# EAGLE design icemaker (EAGLE 9.2.2)
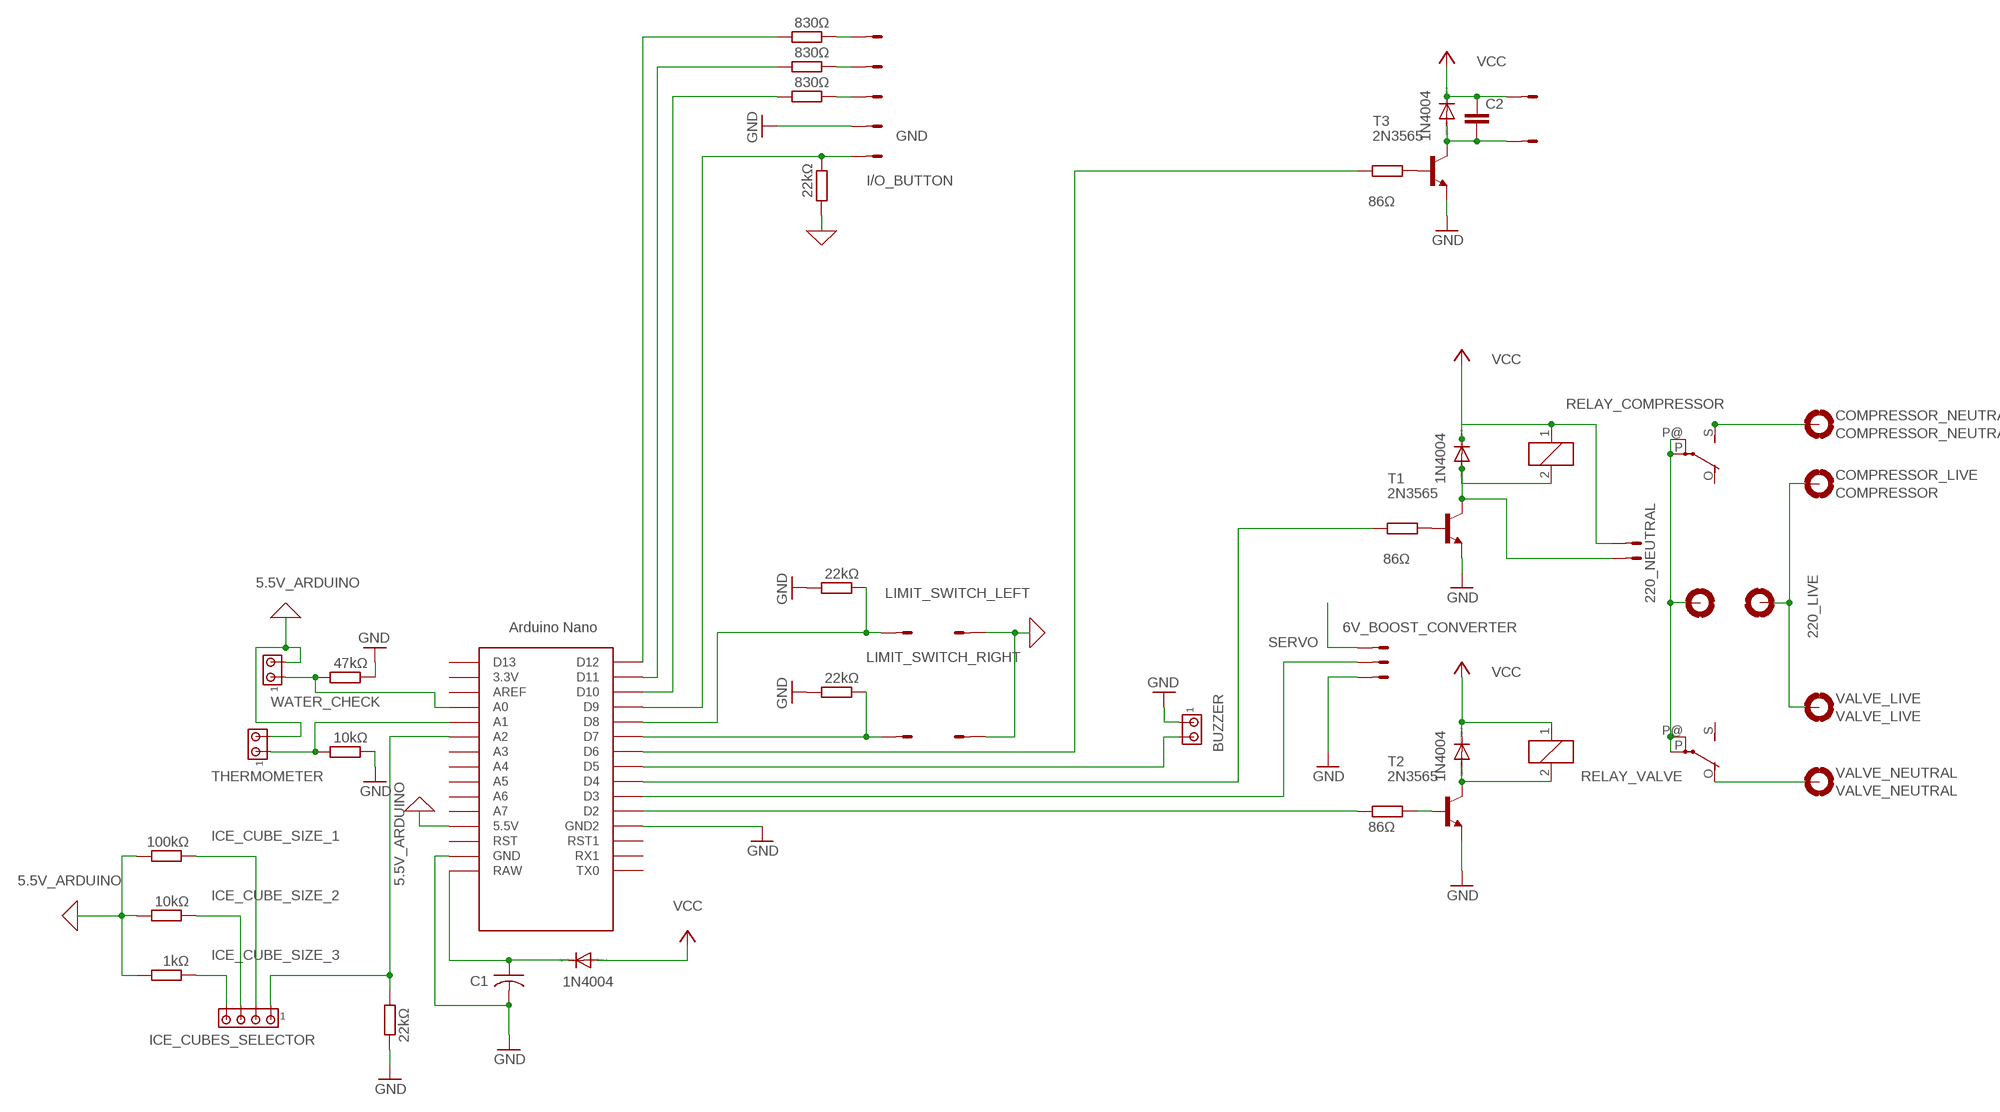
[diagram p0: schematic, sheet 1]

## Parts
220_LIVE  220_LIVE  MOUNT-PAD-ROUND2.8  [2,8-PAD]
220_NEUTRLA  220_NEUTRAL  MOUNT-PAD-ROUND2.8  [2,8-PAD]
BUZZER  MTA02-156  [1X2MTA]
C1  C-US050-025X075  [C050-025X075]
C2  C2,5-3  [C2.5-3]
COMPRESSOR_LIVE  COMPRESSOR  MOUNT-PAD-ROUND2.8  [2,8-PAD]
COMPRESSOR_NEUTRAL  COMPRESSOR_NEUTRAL  MOUNT-PAD-ROUND2.8  [2,8-PAD]
D1  1N4004  [DO41-10]
D2  1N4004  [DO41-10]
D3  1N4004  [DO41-10]
D4  1N4004  [DO41-10]
FAN  L02P  [L02P]
ICE_CUBES_SELECTOR  MTA04-156  [1X4MTA]
LED_WORK  I/O_BUTTON  L05P  [L05P]
PUMP  L02P  [L02P]
R1  86Ω  R-EU_0204/5  [0204/5]
R2  86Ω  R-EU_0204/5  [0204/5]
R3  86Ω  R-EU_0204/5  [0204/5]
R4  1kΩ  R-EU_0204/5  [0204/5]
R5  47kΩ  R-EU_0204/5  [0204/5]
R6  10kΩ  R-EU_0204/5  [0204/5]
R7  830Ω  R-EU_0204/5  [0204/5]
R8  830Ω  R-EU_0204/5  [0204/5]
R9  830Ω  R-EU_0204/5  [0204/5]
R10  22kΩ  R-EU_0204/5  [0204/5]
R11  22kΩ  R-EU_0204/5  [0204/5]
R12  22kΩ  R-EU_0204/5  [0204/5]
R13  10kΩ  R-EU_0204/5  [0204/5]
R14  100kΩ  R-EU_0204/5  [0204/5]
R16  22kΩ  R-EU_0204/5  [0204/5]
RELAY_COMPRESSOR  M3XXH  [M3XXH]
RELAY_VALVE  M3XXH  [M3XXH]
SERVO  S03P  [S03P]
SV1  L04P  [L04P]
T1  2N3565  [TO92]
T2  2N3565  [TO92]
T3  2N3565  [TO92]
THERMOMETER  MTA02-156  [1X2MTA]
U$1  NANO  [NANO]
VALVE_LIVE  VALVE_LIVE  MOUNT-PAD-ROUND2.8  [2,8-PAD]
VALVE_NEUTRAL  VALVE_NEUTRAL  MOUNT-PAD-ROUND2.8  [2,8-PAD]
WATER_CHECK  MTA02-156  [1X2MTA]

## Nets
5.5V_ARDUINO: R4.2 R10.2 R13.2 R14.2 SV1.2 SV1.3 THERMOMETER.2 U$1.5V(5.5V) WATER_CHECK.2
6V_BOOST_CONVERTER: SERVO.3
220_NEUTRAL: 220_NEUTRLA.B2,8(MOUNT) RELAY_COMPRESSOR.P(2:P) RELAY_COMPRESSOR.P@(2:P) RELAY_VALVE.P(2:P) RELAY_VALVE.P@(2:P)
220V: 220_LIVE.B2,8(MOUNT) COMPRESSOR_LIVE.B2,8(MOUNT) VALVE_LIVE.B2,8(MOUNT)
BUZZER: BUZZER.2 U$1.D5
GND: BUZZER.1 C1.2 LED_WORK.2 R5.1 R6.1 R11.2 R12.2 R16.1 SERVO.1 T1.3(E) T2.3(E) T3.3(E) U$1.GND U$1.GND1(GND2)
I/O_BUTTON: LED_WORK.1 R10.1 U$1.D9
ICE_CUBE_SIZE_1: ICE_CUBES_SELECTOR.2 R14.1
ICE_CUBE_SIZE_2: ICE_CUBES_SELECTOR.3 R13.1
ICE_CUBE_SIZE_3: ICE_CUBES_SELECTOR.4 R4.1
LIMIT_SWITCH_LEFT: R11.1 SV1.4 U$1.D8
LIMIT_SWITCH_RIGHT: R12.1 SV1.1 U$1.D7
N$1: D1.A RELAY_VALVE.2 T2.1(C)
N$2: R3.2 U$1.D2
N$3: R2.2 U$1.D6
N$4: R2.1 T3.2(B)
N$5: R3.1 T2.2(B)
N$6: R1.2 U$1.D4
N$7: LED_WORK.5 R7.1
N$8: LED_WORK.4 R8.1
N$9: R7.2 U$1.D12
N$10: R8.2 U$1.D11
N$11: R9.2 U$1.D10
N$12: LED_WORK.3 R9.1
N$13: R1.1 T1.2(B)
N$14: D2.A FAN.1 RELAY_COMPRESSOR.2 T1.1(C)
N$15: C1.1 D3.C U$1.RAW
N$16: RELAY_VALVE.O(2:O) VALVE_NEUTRAL.B2,8(MOUNT)
N$17: COMPRESSOR_NEUTRAL.B2,8(MOUNT) RELAY_COMPRESSOR.S(2:S)
N$19: ICE_CUBES_SELECTOR.1 R16.2 U$1.A2
N$20: C2.2 D4.A PUMP.1 T3.1(C)
SERVO: SERVO.2 U$1.D3
THERMOMETER: R6.2 THERMOMETER.1 U$1.A1
VCC: C2.1 D1.C D2.C D3.A D4.C FAN.2 PUMP.2 RELAY_COMPRESSOR.1 RELAY_VALVE.1
WATER_CHECK: R5.2 U$1.A0 WATER_CHECK.1
Unconnected: RELAY_COMPRESSOR.O(2:O) RELAY_VALVE.S(2:S) U$1.3.3V U$1.A3 U$1.A4 U$1.A5 U$1.A6 U$1.A7 U$1.AREF U$1.D13 U$1.ICSP1 U$1.ICSP2 U$1.ICSP3 U$1.ICSP4 U$1.ICSP5 U$1.ICSP6 U$1.RST U$1.RST1 U$1.RX1 U$1.TX0

## Library data of the parts
220_LIVE 220_NEUTRLA COMPRESSOR_LIVE COMPRESSOR_NEUTRAL VALVE_LIVE VALVE_NEUTRAL = holes:MOUNT-PAD-ROUND: MOUNTING PAD, round
BUZZER THERMOMETER WATER_CHECK = con-amp:MTA02-156: AMP connector
C1 = rcl:C-US: CAPACITOR, American symbol; SPICEPREFIX: C
C2 = capacitor-wima:C: CAPACITOR naming: grid - package width
D1-D4 = diode:1N4004: DIODE general purpose rectifier, 1 A
FAN PUMP = con-amp-mt:L02P: AMP MT CONNECTOR; OC_FARNELL: unknown; OC_NEWARK: unknown
ICE_CUBES_SELECTOR = con-amp:MTA04-156: AMP connector
LED_WORK = con-amp-mt:L05P: AMP MT CONNECTOR; OC_FARNELL: unknown; OC_NEWARK: unknown
R1-R14 R16 = rcl:R-EU_: RESISTOR, European symbol; SPICEPREFIX: R
RELAY_COMPRESSOR RELAY_VALVE = relay:M3XXH: RELAY 1 x switch
SERVO = con-amp-mt:S03P: AMP MT CONNECTOR; OC_FARNELL: unknown; OC_NEWARK: unknown
SV1 = con-amp-mt:L04P: AMP MT CONNECTOR; OC_FARNELL: unknown; OC_NEWARK: unknown
T1-T3 = transistor:2N3565: NPN TRANSISTOR
U$1 = Arduino-clone:NANO: Arduino Nano

## Board
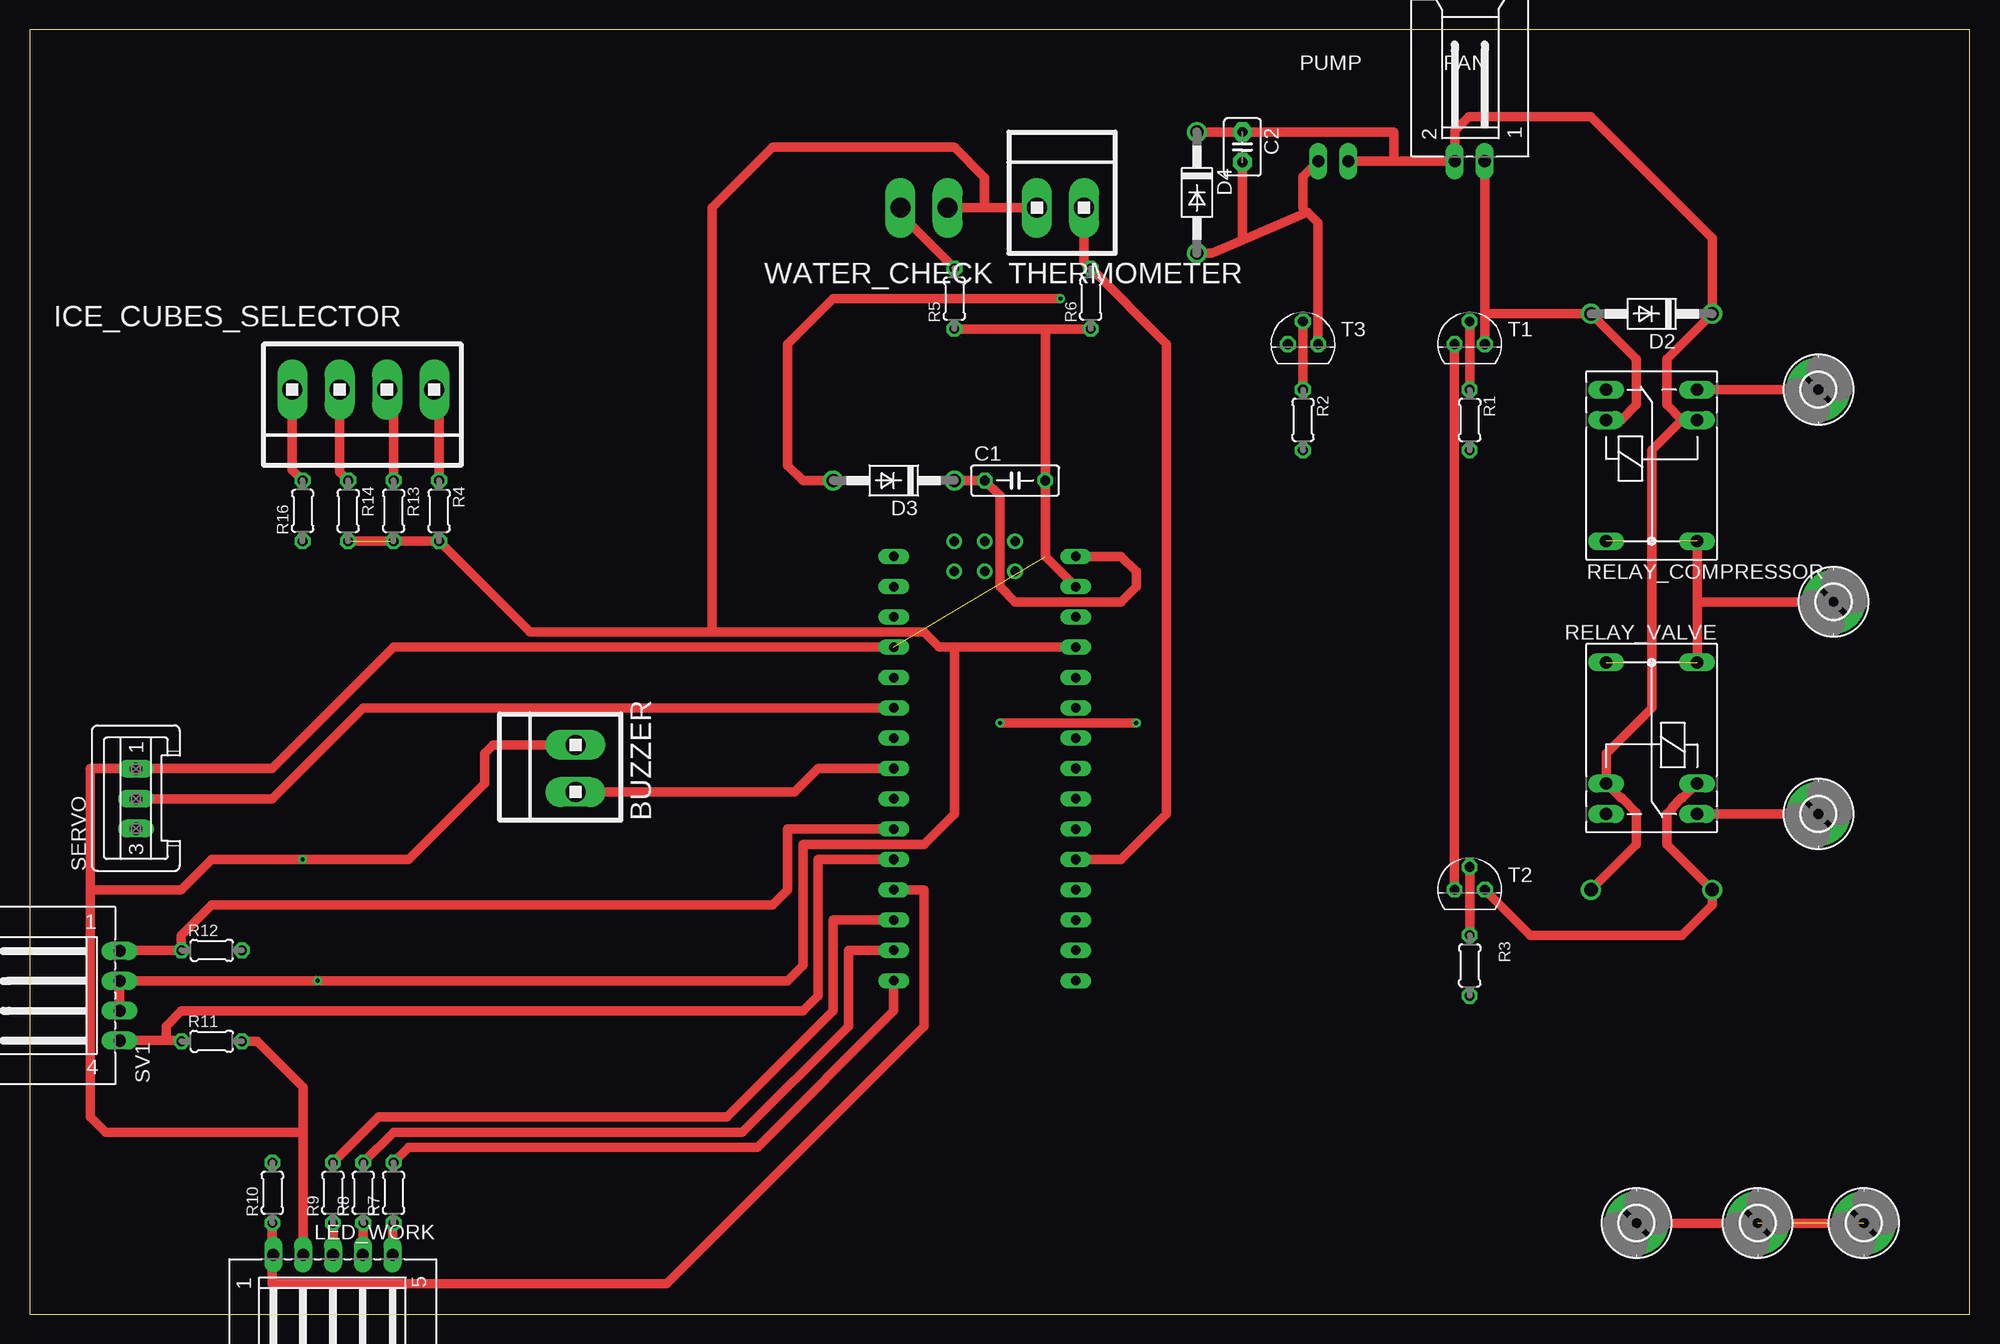
[diagram p1: board, top side]
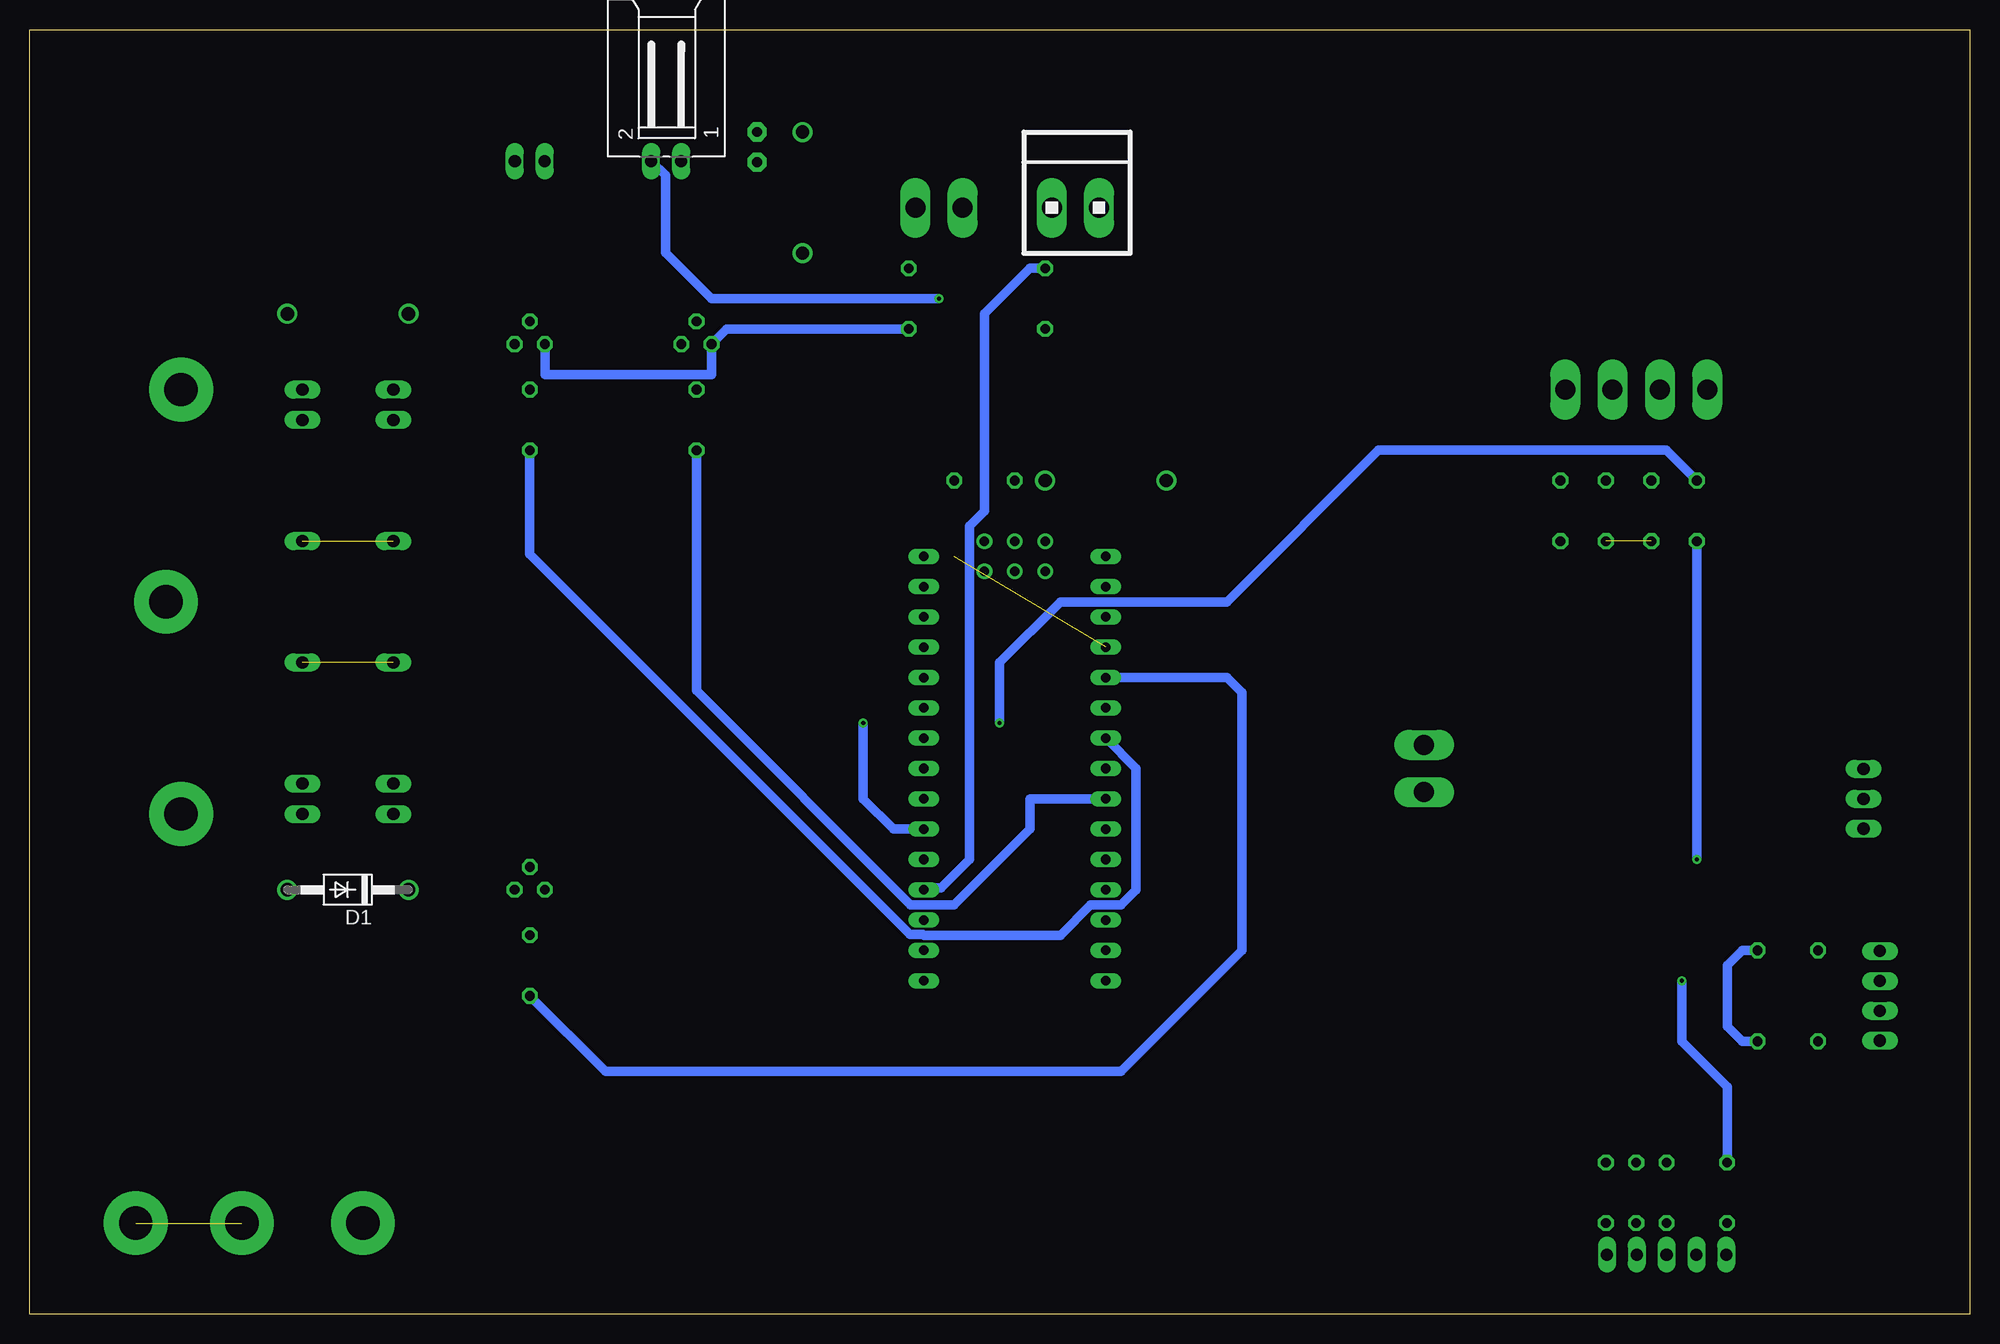
[diagram p2: board, bottom side, seen from below]

Size 162.54 x 107.62 mm. Coordinates in mm from the lower left corner, seen from the top.
Outline: 0,0 162.54,0 162.54,107.62 0,107.62 0,0
Copper layers (1*16): Top 0.035mm / dielectric 1.5mm / Bottom 0.035mm
Design rules "default": minimum track width 6mil, minimum drill 0.35mm, track to track 6mil, track to pad 6mil, pad to pad 6mil, via to via 6mil, smd to smd 6mil, copper to edge 40mil, drill to drill 6mil, minimum pad ring 10mil, minimum via ring 8mil, stop-mask expansion 4mil, vias tented up to drill 0mil, thermal gap 10mil

### Footprints (pad centres in the part's own frame; a part is rotated, then mirrored left to right if it is on the bottom)
2,8-PAD = drill 2.8 pad 5.334: B2,8 0,0
1X2MTA = drill 1.676 long: 1 1.981,0; 2 -1.981,0
C050-025X075 = drill 0.813 octagon: 1 -2.54,0; 2 2.54,0
C2.5-3 = drill 0.813 pad 1.6 octagon: 1 -1.27,0; 2 1.27,0
DO41-10 = drill 1.118: A 5.08,0; C -5.08,0
L02P = drill 1.016 long: 1 1.25,-6.25; 2 -1.25,-6.25
1X4MTA = drill 1.676 long: 1 5.944,0; 2 1.981,0; 3 -1.981,0; 4 -5.944,0
L05P = drill 1.016 long: 1 5,-6.25; 2 2.5,-6.25; 3 0,-6.25; 4 -2.5,-6.25; 5 -5,-6.25
0204/5 = drill 0.813 octagon: 1 -2.54,0; 2 2.54,0
M3XXH = drill 1.016 long: 1 -3.81,3.81; 2 -3.81,-3.81; O -6.35,-3.81; P 6.35,-3.81; P@ 6.35,3.81; S -6.35,3.81
S03P = drill 1.016 long: 1 2.5,0; 2 0,0; 3 -2.5,0
L04P = drill 1.016 long: 1 3.75,-6.25; 2 1.25,-6.25; 3 -1.25,-6.25; 4 -3.75,-6.25
TO92 = drill 0.813 octagon: 1 1.27,0; 2 0,1.905; 3 -1.27,0
NANO = drill 0.8 long: 3.3V -10.16,24.13; 5V -10.16,-1.27; A0 -10.16,19.05; A1 -10.16,16.51; A2 -10.16,13.97; A3 -10.16,11.43; A4 -10.16,8.89; A5 -10.16,6.35; A6 -10.16,3.81; A7 -10.16,1.27; AREF -10.16,21.59; D2 5.08,1.27; D3 5.08,3.81; D4 5.08,6.35; D5 5.08,8.89; D6 5.08,11.43; D7 5.08,13.97; D8 5.08,16.51; D9 5.08,19.05; D10 5.08,21.59; D11 5.08,24.13; D12 5.08,26.67; D13 -10.16,26.67; GND -10.16,-6.35; GND1 5.08,-1.27; RAW -10.16,-8.89; RST -10.16,-3.81; RST1 5.08,-3.81; RX1 5.08,-6.35; TX0 5.08,-8.89 | drill 0.8: ICSP1 -5.08,-10.16; ICSP2 -5.08,-7.62; ICSP3 -2.54,-10.16; ICSP4 -2.54,-7.62; ICSP5 0,-10.16; ICSP6 0,-7.62

### Placement (x,y rotation side)
220_LIVE  153.67,7.62 0 top
220_NEUTRLA  151.13,59.69 0 top
BUZZER  45.72,45.72 90 top
C1  82.55,69.85 0 top
C2  101.6,97.79 270 top
COMPRESSOR_LIVE  144.78,7.62 0 top
COMPRESSOR_NEUTRAL  149.86,77.47 0 top
D1  135.89,35.56 180 bottom
D2  135.89,83.82 180 top
D3  72.39,69.85 180 top
D4  97.79,93.98 270 top
FAN  120.65,102.87 0 top
ICE_CUBES_SELECTOR  27.94,77.47 180 top
LED_WORK  25.4,-1.27 180 top
PUMP  109.22,102.87 0 bottom
R1  120.65,74.93 270 top
R2  106.68,74.93 270 top
R3  120.65,29.21 270 top
R4  34.29,67.31 270 top
R5  77.47,85.09 90 top
R6  88.9,85.09 90 top
R7  30.48,10.16 90 top
R8  27.94,10.16 90 top
R9  25.4,10.16 90 top
R10  20.32,10.16 90 top
R11  15.24,22.86 0 top
R12  15.24,30.48 0 top
R13  30.48,67.31 270 top
R14  26.67,67.31 270 top
R16  22.86,67.31 90 top
RELAY_COMPRESSOR  135.89,71.12 270 top
RELAY_VALVE  135.89,48.26 90 top
SERVO  8.89,43.18 90 top
SV1  1.27,26.67 90 top
T1  120.65,81.28 0 top
T2  120.65,35.56 0 top
T3  106.68,81.28 0 top
THERMOMETER  86.36,92.71 0 top
U$1  77.47,54.61 180 top
VALVE_LIVE  134.62,7.62 0 top
VALVE_NEUTRAL  149.86,41.91 0 top
WATER_CHECK  74.93,92.71 0 bottom

### Tracks (layer width: path | path; a pad name or v marks a point on that pad's centre or on a via)
5.5V_ARDUINO  (via drill 0.35)  (1 unrouted)
  Top 0.813: SV1.3 SV1.2 7.54,27.94 v24.13,27.94 63.5,27.94 64.77,29.21 64.77,39.37 74.93,39.37 77.47,41.91 77.47,55.88 | 77.47,55.88 U$1.5V | 77.47,55.88 76.2,55.88 74.93,57.15 57.15,57.15 | 57.15,57.15 41.91,57.15 R4.2 R14.2 | THERMOMETER.2 80.01,92.71 | 80.01,92.71 WATER_CHECK.2 | 80.01,92.71 80.01,95.25 77.47,97.79 62.23,97.79 57.15,92.71 57.15,57.15
  Bottom 0.813: R10.2 20.32,19.05 24.13,22.86 v24.13,27.94
220_NEUTRAL  (2 unrouted)
  Top 0.813: RELAY_COMPRESSOR.P@ 139.7,59.69 | 139.7,59.69 RELAY_VALVE.P | 139.7,59.69 220_NEUTRLA.B2,8 152.4,59.69
220V  (1 unrouted)
  Top 0.813: 220_LIVE.B2,8 VALVE_LIVE.B2,8
BUZZER
  Top 0.813: BUZZER.2 64.06,43.74 66.04,45.72 U$1.D5
GND  (via drill 0.35)  (1 unrouted)
  Top 0.813: LED_WORK.2 22.9,15.24 | 22.9,15.24 22.9,19.01 19.05,22.86 R11.2 | 5.08,35.56 5.08,45.72 8.85,45.72 SERVO.1 8.93,45.72 20.32,45.72 30.48,55.88 U$1.GND1 | 5.08,35.56 5.08,16.51 6.35,15.24 22.9,15.24 | 5.08,35.56 12.7,35.56 15.24,38.1 v22.86,38.1 31.75,38.1 38.1,44.45 38.1,46.99 38.81,47.7 BUZZER.1 | R6.1 85.09,82.55 | 85.09,82.55 R5.1 | U$1.GND 85.09,63.5 C1.2 85.09,71.12 85.09,82.55 | T1.3 T2.3
  Bottom 0.813: R12.2 19.05,30.48 20.32,29.21 20.32,24.13 19.05,22.86 R11.2 | v22.86,38.1 R16.1 | T1.3 119.38,78.74 105.41,78.74 T3.3 104.14,82.55 R6.1
I/O_BUTTON
  Top 0.813: R10.1 20.32,5.06 LED_WORK.1 20.32,4.9 20.32,2.54 53.34,2.54 74.93,24.13 74.93,35.56 U$1.D9
ICE_CUBE_SIZE_1
  Top 0.813: ICE_CUBES_SELECTOR.2 25.96,70.56 R14.1
ICE_CUBE_SIZE_2
  Top 0.813: ICE_CUBES_SELECTOR.3 30.48,76.91 R13.1
ICE_CUBE_SIZE_3
  Top 0.813: ICE_CUBES_SELECTOR.4 34.29,77.06 R4.1
LIMIT_SWITCH_LEFT
  Top 0.813: R11.1 12.64,22.92 11.43,22.92 | 11.43,22.92 SV1.4 | 11.43,22.92 11.43,24.13 12.7,25.4 64.77,25.4 66.04,26.67 66.04,38.1 U$1.D8
LIMIT_SWITCH_RIGHT
  Top 0.813: SV1.1 7.58,30.48 R12.1 12.7,31.75 15.24,34.29 62.23,34.29 63.5,35.56 63.5,40.64 U$1.D7
N$1
  Top 0.813: T2.1 125.73,31.75 138.43,31.75 140.97,34.29 D1.A 137.16,39.37 137.16,41.91 137.62,42.37 137.62,42.46 138.39,43.23 138.48,43.23 RELAY_VALVE.2
N$2
  Bottom 0.813: R3.2 114.3,20.32 71.12,20.32 60.96,30.48 60.96,52.07 62.23,53.34 U$1.D2
N$3
  Bottom 0.813: R2.2 106.68,52.24 88.73,34.29 85.09,34.29 78.74,40.64 78.74,43.18 U$1.D6
N$4
  Top 0.813: R2.1 T3.2
N$5
  Top 0.813: T2.2 R3.1
N$6
  Bottom 0.813: R1.2 120.65,63.67 88.79,31.81 87.69,31.81 87.63,31.75 76.2,31.75 73.66,34.29 71.12,34.29 69.85,35.56 69.85,45.72 U$1.D4
N$7
  Top 0.813: LED_WORK.5 30.4,7.54 R7.1
N$8
  Top 0.813: R8.1 27.94,6.35 27.9,6.31 LED_WORK.4
N$9
  Top 0.813: R7.2 31.75,13.97 60.96,13.97 72.39,25.4 U$1.D12
N$10
  Top 0.813: R8.2 30.48,15.24 59.69,15.24 68.58,24.13 68.58,30.48 U$1.D11
N$11
  Top 0.813: U$1.D10 67.31,33.02 67.31,25.4 58.42,16.51 29.21,16.51 R9.2
N$12
  Top 0.813: R9.1 LED_WORK.3
N$13
  Top 0.813: T1.2 R1.1
N$14
  Top 0.813: FAN.1 121.92,96.6 121.92,83.82 | 121.92,83.82 T1.1 | RELAY_COMPRESSOR.2 133.35,74.93 134.62,76.2 134.62,80.01 D2.A 121.92,83.82
N$15
  Top 0.813: D3.C C1.1 81.28,68.58 81.28,60.96 82.55,59.69 91.44,59.69 92.71,60.96 92.71,62.23 91.44,63.5 U$1.RAW
N$16
  Top 0.813: VALVE_NEUTRAL.B2,8 RELAY_VALVE.O
N$17
  Top 0.813: COMPRESSOR_NEUTRAL.B2,8 RELAY_COMPRESSOR.S
N$19  (via drill 0.35)
  Top 0.813: ICE_CUBES_SELECTOR.1 22,70.71 R16.2 | v81.28,49.53 v92.71,49.53
  Bottom 0.813: R16.2 25.4,72.39 49.53,72.39 62.23,59.69 76.2,59.69 81.28,54.61 v81.28,49.53 | U$1.A2 90.17,40.64 92.71,43.18 v92.71,49.53
N$20
  Top 0.813: T3.1 107.95,91.44 107.06,92.33 101.6,89.99 | 106.68,92.71 106.68,95.33 PUMP.1 | C2.2 101.6,89.99 | 101.6,89.99 99.06,88.9 D4.A
SERVO
  Top 0.813: U$1.D3 27.94,50.8 20.32,43.18 SERVO.2
THERMOMETER
  Top 0.813: THERMOMETER.1 88.34,88.19 R6.2 95.25,81.28 95.25,41.91 91.44,38.1 U$1.A1
VCC  (via drill 0.35)
  Top 0.813: D1.C 134.62,39.37 134.62,42 133.39,43.23 133.3,43.23 RELAY_VALVE.1 132.08,46.99 135.89,50.8 135.89,72.39 138.43,74.93 | RELAY_COMPRESSOR.1 138.43,74.93 | 138.43,74.93 137.16,76.2 137.16,80.01 D2.C 140.97,90.17 130.81,100.33 120.57,100.33 119.4,99.16 FAN.2 114.3,96.62 | D3.A 64.77,69.85 63.5,71.12 63.5,81.28 67.31,85.09 v86.36,85.09 | 114.3,96.62 PUMP.2 | D4.C C2.1 114.3,99.06 114.3,96.62
  Bottom 0.813: v86.36,85.09 105.42,85.09 109.29,88.96 109.29,95.44 PUMP.2
WATER_CHECK
  Top 0.813: R5.2 73.66,91.44 72.39,91.44 72.39,92.15 WATER_CHECK.1
  Bottom 0.813: R5.2 78.74,87.63 82.55,83.82 82.55,67.31 83.82,66.04 83.82,38.1 86.19,35.73 87.63,35.73 U$1.A0